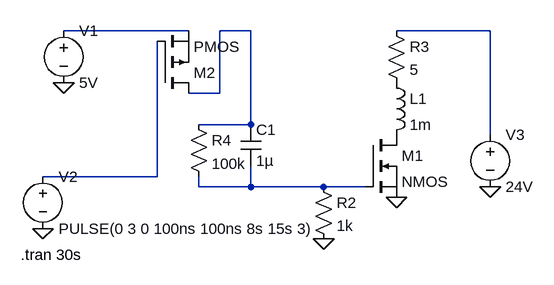
[diagram p0: schematic simulation.asc]
simulation.asc, the LTspice schematic file:
Version 4
SHEET 1 880 680
WIRE -112 -64 -304 -64
WIRE -16 -64 -64 -64
WIRE 352 -64 208 -64
WIRE -64 32 -64 -64
WIRE -64 32 -112 32
WIRE -16 80 -16 -64
WIRE -16 80 -96 80
WIRE 352 96 352 -64
WIRE -160 160 -160 -48
WIRE -160 160 -336 160
WIRE -96 176 -96 160
WIRE -16 176 -16 144
WIRE -16 176 -96 176
WIRE 96 176 -16 176
WIRE 160 176 96 176
FLAG -336 240 0
FLAG 208 192 0
FLAG 352 176 0
FLAG -304 16 0
FLAG 96 256 0
SYMBOL nmos 160 96 R0
SYMATTR InstName M1
SYMBOL cap -32 80 R0
SYMATTR InstName C1
SYMATTR Value 1µ
SYMBOL voltage -304 -80 R0
WINDOW 123 0 0 Left 2
WINDOW 39 0 0 Left 2
SYMATTR InstName V1
SYMATTR Value 5V
SYMBOL voltage -336 144 R0
WINDOW 123 0 0 Left 2
WINDOW 39 0 0 Left 2
SYMATTR InstName V2
SYMATTR Value PULSE(0 3 0 100ns 100ns 8s 15s 3)
SYMBOL ind 192 0 R0
SYMATTR InstName L1
SYMATTR Value 1m
SYMBOL voltage 352 80 R0
WINDOW 123 0 0 Left 2
WINDOW 39 0 0 Left 2
SYMATTR InstName V3
SYMATTR Value 24V
SYMBOL res 192 -80 R0
SYMATTR InstName R3
SYMATTR Value 5
SYMBOL pmos -160 32 M180
SYMATTR InstName M2
SYMBOL res 80 160 R0
SYMATTR InstName R2
SYMATTR Value 1k
SYMBOL res -112 64 R0
SYMATTR InstName R4
SYMATTR Value 100k
TEXT -370 280 Left 2 !.tran 30s

The netlist it stands for:
* simulation.asc
M1 P001 N005 0 0 NMOS
C1 N002 N005 1µ
V1 N001 0 5V
V2 N004 0 PULSE(0 3 0 100ns 100ns 8s 15s 3)
L1 P002 P001 1m
V3 N003 0 24V
R3 N003 P002 5
M2 N002 N004 N001 N001 PMOS
R2 N005 0 1k
R4 N002 N005 100k
.model NMOS NMOS
.model PMOS PMOS
.lib standard.mos
.tran 30s
.backanno
.end